# Altium schematic sheet Esark Sign Schematic.SchDoc
size D; SheetNumber: 1; SheetTotal: 1
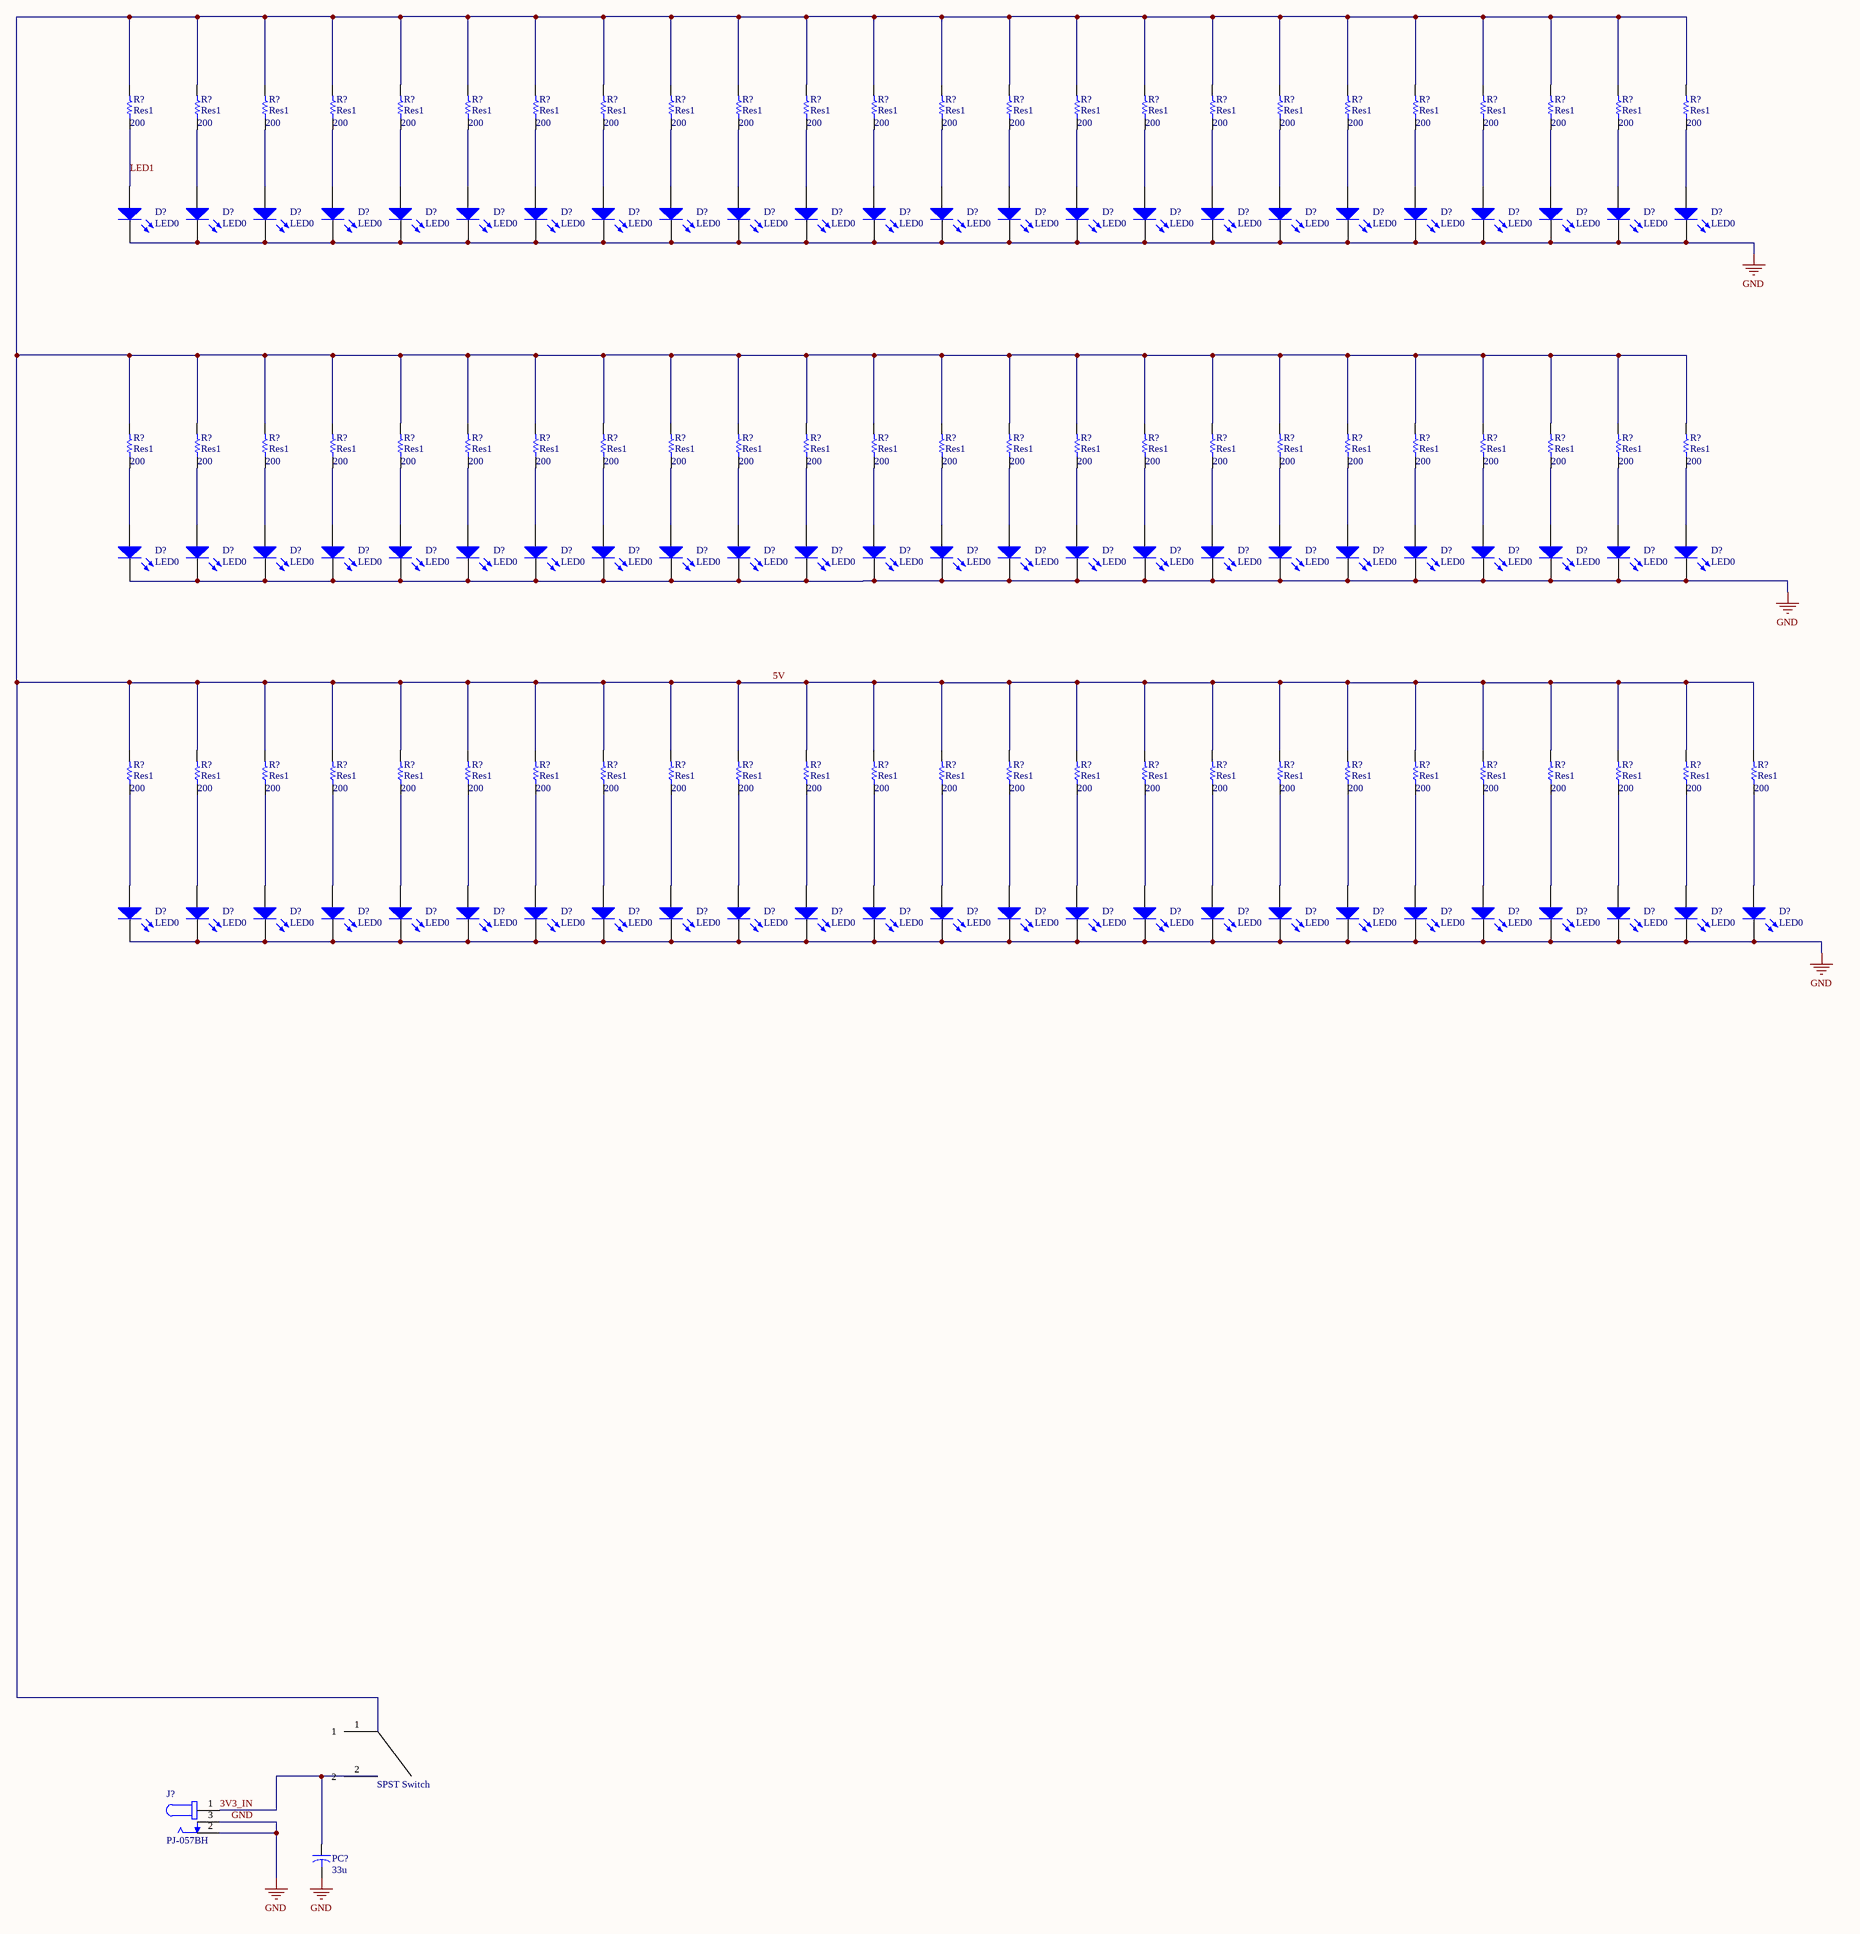
[diagram p0: Esark Sign Schematic.SchDoc]

## Parts
(Parts that share a designator on the sheet are numbered #1, #2 ... from top to bottom, then left to right.)
?  SPST Switch  [SPST Switch]
D?#1  LED0  [LED-0]
D?#2  LED0  [LED-0]
D?#3  LED0  [LED-0]
D?#4  LED0  [LED-0]
D?#5  LED0  [LED-0]
D?#6  LED0  [LED-0]
D?#7  LED0  [LED-0]
D?#8  LED0  [LED-0]
D?#9  LED0  [LED-0]
D?#10  LED0  [LED-0]
D?#11  LED0  [LED-0]
D?#12  LED0  [LED-0]
D?#13  LED0  [LED-0]
D?#14  LED0  [LED-0]
D?#15  LED0  [LED-0]
D?#16  LED0  [LED-0]
D?#17  LED0  [LED-0]
D?#18  LED0  [LED-0]
D?#19  LED0  [LED-0]
D?#20  LED0  [LED-0]
D?#21  LED0  [LED-0]
D?#22  LED0  [LED-0]
D?#23  LED0  [LED-0]
D?#24  LED0  [LED-0]
D?#25  LED0  [LED-0]
D?#26  LED0  [LED-0]
D?#27  LED0  [LED-0]
D?#28  LED0  [LED-0]
D?#29  LED0  [LED-0]
D?#30  LED0  [LED-0]
D?#31  LED0  [LED-0]
D?#32  LED0  [LED-0]
D?#33  LED0  [LED-0]
D?#34  LED0  [LED-0]
D?#35  LED0  [LED-0]
D?#36  LED0  [LED-0]
D?#37  LED0  [LED-0]
D?#38  LED0  [LED-0]
D?#39  LED0  [LED-0]
D?#40  LED0  [LED-0]
D?#41  LED0  [LED-0]
D?#42  LED0  [LED-0]
D?#43  LED0  [LED-0]
D?#44  LED0  [LED-0]
D?#45  LED0  [LED-0]
D?#46  LED0  [LED-0]
D?#47  LED0  [LED-0]
D?#48  LED0  [LED-0]
D?#49  LED0  [LED-0]
D?#50  LED0  [LED-0]
D?#51  LED0  [LED-0]
D?#52  LED0  [LED-0]
D?#53  LED0  [LED-0]
D?#54  LED0  [LED-0]
D?#55  LED0  [LED-0]
D?#56  LED0  [LED-0]
D?#57  LED0  [LED-0]
D?#58  LED0  [LED-0]
D?#59  LED0  [LED-0]
D?#60  LED0  [LED-0]
D?#61  LED0  [LED-0]
D?#62  LED0  [LED-0]
D?#63  LED0  [LED-0]
D?#64  LED0  [LED-0]
D?#65  LED0  [LED-0]
D?#66  LED0  [LED-0]
D?#67  LED0  [LED-0]
D?#68  LED0  [LED-0]
D?#69  LED0  [LED-0]
D?#70  LED0  [LED-0]
D?#71  LED0  [LED-0]
D?#72  LED0  [LED-0]
D?#73  LED0  [LED-0]
J?  PJ-057BH  [CUI_PJ-057BH]
PC?  33u  [CAPR5-4X5]
R?#1  Res1  value 200  [AXIAL-0.3]
R?#2  Res1  value 200  [AXIAL-0.3]
R?#3  Res1  value 200  [AXIAL-0.3]
R?#4  Res1  value 200  [AXIAL-0.3]
R?#5  Res1  value 200  [AXIAL-0.3]
R?#6  Res1  value 200  [AXIAL-0.3]
R?#7  Res1  value 200  [AXIAL-0.3]
R?#8  Res1  value 200  [AXIAL-0.3]
R?#9  Res1  value 200  [AXIAL-0.3]
R?#10  Res1  value 200  [AXIAL-0.3]
R?#11  Res1  value 200  [AXIAL-0.3]
R?#12  Res1  value 200  [AXIAL-0.3]
R?#13  Res1  value 200  [AXIAL-0.3]
R?#14  Res1  value 200  [AXIAL-0.3]
R?#15  Res1  value 200  [AXIAL-0.3]
R?#16  Res1  value 200  [AXIAL-0.3]
R?#17  Res1  value 200  [AXIAL-0.3]
R?#18  Res1  value 200  [AXIAL-0.3]
R?#19  Res1  value 200  [AXIAL-0.3]
R?#20  Res1  value 200  [AXIAL-0.3]
R?#21  Res1  value 200  [AXIAL-0.3]
R?#22  Res1  value 200  [AXIAL-0.3]
R?#23  Res1  value 200  [AXIAL-0.3]
R?#24  Res1  value 200  [AXIAL-0.3]
R?#25  Res1  value 200  [AXIAL-0.3]
R?#26  Res1  value 200  [AXIAL-0.3]
R?#27  Res1  value 200  [AXIAL-0.3]
R?#28  Res1  value 200  [AXIAL-0.3]
R?#29  Res1  value 200  [AXIAL-0.3]
R?#30  Res1  value 200  [AXIAL-0.3]
R?#31  Res1  value 200  [AXIAL-0.3]
R?#32  Res1  value 200  [AXIAL-0.3]
R?#33  Res1  value 200  [AXIAL-0.3]
R?#34  Res1  value 200  [AXIAL-0.3]
R?#35  Res1  value 200  [AXIAL-0.3]
R?#36  Res1  value 200  [AXIAL-0.3]
R?#37  Res1  value 200  [AXIAL-0.3]
R?#38  Res1  value 200  [AXIAL-0.3]
R?#39  Res1  value 200  [AXIAL-0.3]
R?#40  Res1  value 200  [AXIAL-0.3]
R?#41  Res1  value 200  [AXIAL-0.3]
R?#42  Res1  value 200  [AXIAL-0.3]
R?#43  Res1  value 200  [AXIAL-0.3]
R?#44  Res1  value 200  [AXIAL-0.3]
R?#45  Res1  value 200  [AXIAL-0.3]
R?#46  Res1  value 200  [AXIAL-0.3]
R?#47  Res1  value 200  [AXIAL-0.3]
R?#48  Res1  value 200  [AXIAL-0.3]
R?#49  Res1  value 200  [AXIAL-0.3]
R?#50  Res1  value 200  [AXIAL-0.3]
R?#51  Res1  value 200  [AXIAL-0.3]
R?#52  Res1  value 200  [AXIAL-0.3]
R?#53  Res1  value 200  [AXIAL-0.3]
R?#54  Res1  value 200  [AXIAL-0.3]
R?#55  Res1  value 200  [AXIAL-0.3]
R?#56  Res1  value 200  [AXIAL-0.3]
R?#57  Res1  value 200  [AXIAL-0.3]
R?#58  Res1  value 200  [AXIAL-0.3]
R?#59  Res1  value 200  [AXIAL-0.3]
R?#60  Res1  value 200  [AXIAL-0.3]
R?#61  Res1  value 200  [AXIAL-0.3]
R?#62  Res1  value 200  [AXIAL-0.3]
R?#63  Res1  value 200  [AXIAL-0.3]
R?#64  Res1  value 200  [AXIAL-0.3]
R?#65  Res1  value 200  [AXIAL-0.3]
R?#66  Res1  value 200  [AXIAL-0.3]
R?#67  Res1  value 200  [AXIAL-0.3]
R?#68  Res1  value 200  [AXIAL-0.3]
R?#69  Res1  value 200  [AXIAL-0.3]
R?#70  Res1  value 200  [AXIAL-0.3]
R?#71  Res1  value 200  [AXIAL-0.3]
R?#72  Res1  value 200  [AXIAL-0.3]
R?#73  Res1  value 200  [AXIAL-0.3]

## Nets
GND: D?#1.2(K) D?#2.2(K) D?#3.2(K) D?#4.2(K) D?#5.2(K) D?#6.2(K) D?#7.2(K) D?#8.2(K) D?#9.2(K) D?#10.2(K) D?#11.2(K) D?#12.2(K) D?#13.2(K) D?#14.2(K) D?#15.2(K) D?#16.2(K) D?#17.2(K) D?#18.2(K) D?#19.2(K) D?#20.2(K) D?#21.2(K) D?#22.2(K) D?#23.2(K) D?#24.2(K) D?#25.2(K) D?#26.2(K) D?#27.2(K) D?#28.2(K) D?#29.2(K) D?#30.2(K) D?#31.2(K) D?#32.2(K) D?#33.2(K) D?#34.2(K) D?#35.2(K) D?#36.2(K) D?#37.2(K) D?#38.2(K) D?#39.2(K) D?#40.2(K) D?#41.2(K) D?#42.2(K) D?#43.2(K) D?#44.2(K) D?#45.2(K) D?#46.2(K) D?#47.2(K) D?#48.2(K) D?#49.2(K) D?#50.2(K) D?#51.2(K) D?#52.2(K) D?#53.2(K) D?#54.2(K) D?#55.2(K) D?#56.2(K) D?#57.2(K) D?#58.2(K) D?#59.2(K) D?#60.2(K) D?#61.2(K) D?#62.2(K) D?#63.2(K) D?#64.2(K) D?#65.2(K) D?#66.2(K) D?#67.2(K) D?#68.2(K) D?#69.2(K) D?#70.2(K) D?#71.2(K) D?#72.2(K) D?#73.2(K) J?.2 J?.3 PC?.2
3V3_IN: ?.2 J?.1 PC?.1
5V: ?.1 R?#1.2 R?#2.2 R?#3.2 R?#4.2 R?#5.2 R?#6.2 R?#7.2 R?#8.2 R?#9.2 R?#10.2 R?#11.2 R?#12.2 R?#13.2 R?#14.2 R?#15.2 R?#16.2 R?#17.2 R?#18.2 R?#19.2 R?#20.2 R?#21.2 R?#22.2 R?#23.2 R?#24.2 R?#25.2 R?#26.2 R?#27.2 R?#28.2 R?#29.2 R?#30.2 R?#31.2 R?#32.2 R?#33.2 R?#34.2 R?#35.2 R?#36.2 R?#37.2 R?#38.2 R?#39.2 R?#40.2 R?#41.2 R?#42.2 R?#43.2 R?#44.2 R?#45.2 R?#46.2 R?#47.2 R?#48.2 R?#49.2 R?#50.2 R?#51.2 R?#52.2 R?#53.2 R?#54.2 R?#55.2 R?#56.2 R?#57.2 R?#58.2 R?#59.2 R?#60.2 R?#61.2 R?#62.2 R?#63.2 R?#64.2 R?#65.2 R?#66.2 R?#67.2 R?#68.2 R?#69.2 R?#70.2 R?#71.2 R?#72.2 R?#73.2
LED1: D?#1.1(A) R?#1.1
NetD?#2_1: D?#2.1(A) R?#2.1
NetD?#3_1: D?#3.1(A) R?#3.1
NetD?#4_1: D?#4.1(A) R?#4.1
NetD?#5_1: D?#5.1(A) R?#5.1
NetD?#6_1: D?#6.1(A) R?#6.1
NetD?#7_1: D?#7.1(A) R?#7.1
NetD?#8_1: D?#8.1(A) R?#8.1
NetD?#9_1: D?#9.1(A) R?#9.1
NetD?#10_1: D?#10.1(A) R?#10.1
NetD?#11_1: D?#11.1(A) R?#11.1
NetD?#12_1: D?#12.1(A) R?#12.1
NetD?#13_1: D?#13.1(A) R?#13.1
NetD?#14_1: D?#14.1(A) R?#14.1
NetD?#15_1: D?#15.1(A) R?#15.1
NetD?#16_1: D?#16.1(A) R?#16.1
NetD?#17_1: D?#17.1(A) R?#17.1
NetD?#18_1: D?#18.1(A) R?#18.1
NetD?#19_1: D?#19.1(A) R?#19.1
NetD?#20_1: D?#20.1(A) R?#20.1
NetD?#21_1: D?#21.1(A) R?#21.1
NetD?#22_1: D?#22.1(A) R?#22.1
NetD?#23_1: D?#23.1(A) R?#23.1
NetD?#24_1: D?#24.1(A) R?#24.1
NetD?#25_1: D?#25.1(A) R?#25.1
NetD?#26_1: D?#26.1(A) R?#26.1
NetD?#27_1: D?#27.1(A) R?#27.1
NetD?#28_1: D?#28.1(A) R?#28.1
NetD?#29_1: D?#29.1(A) R?#29.1
NetD?#30_1: D?#30.1(A) R?#30.1
NetD?#31_1: D?#31.1(A) R?#31.1
NetD?#32_1: D?#32.1(A) R?#32.1
NetD?#33_1: D?#33.1(A) R?#33.1
NetD?#34_1: D?#34.1(A) R?#34.1
NetD?#35_1: D?#35.1(A) R?#35.1
NetD?#36_1: D?#36.1(A) R?#36.1
NetD?#37_1: D?#37.1(A) R?#37.1
NetD?#38_1: D?#38.1(A) R?#38.1
NetD?#39_1: D?#39.1(A) R?#39.1
NetD?#40_1: D?#40.1(A) R?#40.1
NetD?#41_1: D?#41.1(A) R?#41.1
NetD?#42_1: D?#42.1(A) R?#42.1
NetD?#43_1: D?#43.1(A) R?#43.1
NetD?#44_1: D?#44.1(A) R?#44.1
NetD?#45_1: D?#45.1(A) R?#45.1
NetD?#46_1: D?#46.1(A) R?#46.1
NetD?#47_1: D?#47.1(A) R?#47.1
NetD?#48_1: D?#48.1(A) R?#48.1
NetD?#49_1: D?#49.1(A) R?#49.1
NetD?#50_1: D?#50.1(A) R?#50.1
NetD?#51_1: D?#51.1(A) R?#51.1
NetD?#52_1: D?#52.1(A) R?#52.1
NetD?#53_1: D?#53.1(A) R?#53.1
NetD?#54_1: D?#54.1(A) R?#54.1
NetD?#55_1: D?#55.1(A) R?#55.1
NetD?#56_1: D?#56.1(A) R?#56.1
NetD?#57_1: D?#57.1(A) R?#57.1
NetD?#58_1: D?#58.1(A) R?#58.1
NetD?#59_1: D?#59.1(A) R?#59.1
NetD?#60_1: D?#60.1(A) R?#60.1
NetD?#61_1: D?#61.1(A) R?#61.1
NetD?#62_1: D?#62.1(A) R?#62.1
NetD?#63_1: D?#63.1(A) R?#63.1
NetD?#64_1: D?#64.1(A) R?#64.1
NetD?#65_1: D?#65.1(A) R?#65.1
NetD?#66_1: D?#66.1(A) R?#66.1
NetD?#67_1: D?#67.1(A) R?#67.1
NetD?#68_1: D?#68.1(A) R?#68.1
NetD?#69_1: D?#69.1(A) R?#69.1
NetD?#70_1: D?#70.1(A) R?#70.1
NetD?#71_1: D?#71.1(A) R?#71.1
NetD?#72_1: D?#72.1(A) R?#72.1
NetD?#73_1: D?#73.1(A) R?#73.1

## Library data of the parts
D?#1-D?#73 = LED0: Typical INFRARED GaAs LED; Published: 8-Jun-2000; LatestRevisionDate: 08-Jul-2005; LatestRevisionNote: Mech Layer 1 removed.; PackageReference: LED-0; Publisher: Altium Limited; PackageDescription: LED; 2 Leads
J? = PJ-057BH: 2.5 x 6.3 mm, 5.0 A, Horizontal, Through Hole, Pick-n-Place Top, Dc Power Jack Connector; MF: CUI Devices; Package: None; Value: *; Price: None; MP: PJ-057BH; SnapEDA_Link: https://www.snapeda.com/parts/PJ-057BH/CUI%20Devices/view-part/590963/?ref=snap; Availability: Unavailable
PC? = Cap2: Capacitor; Published: 23-Sep-2002; PackageReference: CAPR5-4X5; Publisher: Altium Limited; PackageDescription: Capacitor; 2 Leads
R?#1-R?#73 = Res1: Resistor; Published: 8-Jun-2000; LatestRevisionDate: 17-Jul-2002; LatestRevisionNote: Re-released for DXP Platform.; PackageReference: AXIAL-0.3; Publisher: Altium Limited; PackageDescription: Axial Device, Thru-Hole; 2 Leads; 0.3 in Pin Spacing